# EAGLE design NCP346 (EAGLE 6.6.0)
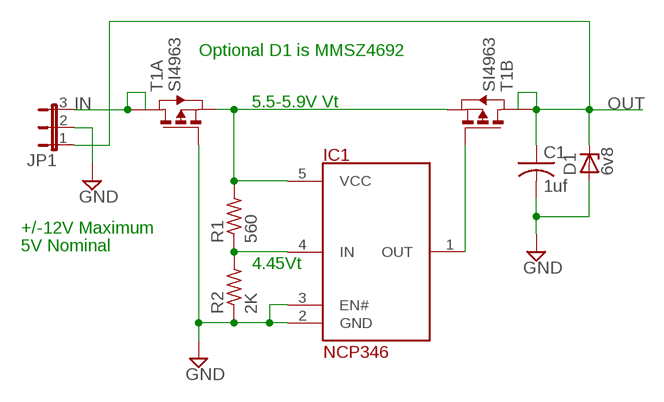
[diagram p0: schematic, sheet 1]

## Parts
C1  1uf  C-USC1206  [C1206]
D1  6v8  ZENER-DIODESOD80C  [SOD80C]
IC1  NCP346  [SOT23-5]
JP1  JP2W  [JP2W]
R1  560  R-US_R0603  [R0603]
R2  2K  R-US_R0603  [R0603]
T1  SI4963  [SO8]

## Nets
GND [power]: C1.2 D1.A IC1.2(GND) IC1.3(EN#) JP1.2 R2.1 T1.4(A:G)
IN [power]: JP1.3 T1.5(A:D) T1.6(A:D1)
N$2: IC1.1(OUT) T1.2(B:G)
N$3: IC1.4(IN) R1.1 R2.2
OUT [power]: C1.1 D1.C JP1.1 T1.7(B:D) T1.8(B:D1)
VCC [power]: IC1.5(VCC) R1.2 T1.1(B:S) T1.3(A:S)

## Notes on the sheet
- Optional D1 is MMSZ4692
- 5.5-5.9V Vt
- +/-12V Maximum
- 5V Nominal
- 4.45Vt

## Library data of the parts
C1 = rcl:C-US: CAPACITOR, American symbol
D1 = diode:ZENER-DIODE: Z-Diode
IC1 = OverVoltage:NCP346: NCP346 Voltage Protection
JP1 = jumper:JP2W: JUMPER
R1 R2 = rcl:R-US_: RESISTOR, American symbol
T1 = OverVoltage:SI4963: Dual P-MOSFET 20V 6.2A

## Net classes
1 power: width 0.762 mm

## Board
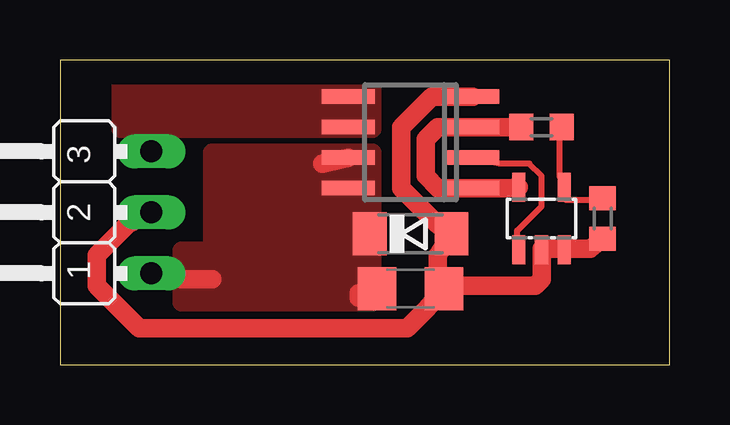
[diagram p1: board, top side]

Size 25.4 x 12.7 mm. Coordinates in mm from the lower left corner, seen from the top.
Outline: 0,0 25.4,0 25.4,12.7 0,12.7 0,0
Copper layers (1*16): Top 0.035mm / dielectric 1.5mm / Bottom 0.035mm
Design rules "olimex10mil": minimum track width 10mil, minimum drill 24mil, track to track 10mil, track to pad 10mil, pad to pad 10mil, via to via 10mil, smd to smd 10mil, copper to edge 40mil, drill to drill 10mil, minimum pad ring 10mil, minimum via ring 8mil, stop-mask expansion 0mil, vias tented up to drill 0mil, thermal gap 10mil

### Footprints (pad centres in the part's own frame; a part is rotated, then mirrored left to right if it is on the bottom)
C1206 = smd 1.6 x 1.8: 1 -1.4,0; 2 1.4,0
SOD80C = smd 1.4 x 1.8: A 1.7,0; C -1.7,0
SOT23-5 = smd 0.55 x 1.2: 1 -0.95,-1.3; 2 0,-1.3; 3 0.95,-1.3; 4 0.95,1.3; 5 -0.95,1.3
JP2W = drill 0.914 long: 1 -2.54,-1.27; 2 0,-1.27; 3 2.54,-1.27
R0603 = smd 1 x 1.1: 1 -0.85,0; 2 0.85,0
SO8 = smd 0.6 x 2.2: 1 -1.905,-2.6; 2 -0.635,-2.6; 3 0.635,-2.6; 4 1.905,-2.6; 5 1.905,2.6; 6 0.635,2.6; 7 -0.635,2.6; 8 -1.905,2.6

### Placement (x,y rotation side)
C1  14.61,3.17 0 top
D1  14.61,5.46 0 top
IC1  20.07,6.1 0 top
JP1  2.54,6.35 90 top
R1  20.07,9.91 180 top
R2  22.61,6.1 90 top
T1  14.61,9.27 90 top

### Tracks (layer width: path | path; a pad name or v marks a point on that pad's centre or on a via)
GND
  Top 0.762: R2.1 22.1,4.83 21.08,4.83 IC1.3 20.57,4.83 20.07,4.83 IC1.2 20.07,4.32 20.07,3.56 19.81,3.3 16.76,3.3 C1.2 | C1.2 15.75,4.06 15.75,4.57 D1.A 15.75,5.84 14.22,7.37 14.22,9.91 15.49,11.18 16.26,11.18 T1.4 | JP1.2 2.79,5.84 1.52,4.57 1.52,3.3 3.3,1.52 14.48,1.52 15.24,2.29 C1.2
IN
  pour Top (no thermals): 2.54,9.84 13.02,9.84 13.02,12.7 2.54,12.7
N$2
  Top 0.254: IC1.1 19.05,5.08 19.05,5.59 20.07,6.6 20.07,7.87 19.56,8.38 18.29,8.38 T1.2
N$3
  Top 0.254: R2.2 22.1,6.86 21.08,6.86 IC1.4 20.83,7.87 20.83,9.4 R1.1
OUT
  Top 0.762: C1.1 12.45,2.79 12.45,2.98 | 6.35,3.56 6.1,3.56 5.08,3.56 JP1.1 | T1.7 10.92,8.38
  pour Top (no thermals): 6.35,2.6 6.35,8.83 13.02,8.83 13.02,2.6
  pour Top (no thermals): 6.35,2.6 5.08,2.6 5.08,4.76 6.35,4.76
VCC
  Top 0.762: IC1.5 18.54,7.37 18.03,7.37 T1.1 16.26,7.37 15.75,7.37 15.24,7.87 15.24,9.4 15.75,9.91 16.26,9.91 T1.3 18.29,9.91 18.8,9.91 R1.2